# EAGLE design tinyvom (EAGLE 5.02)
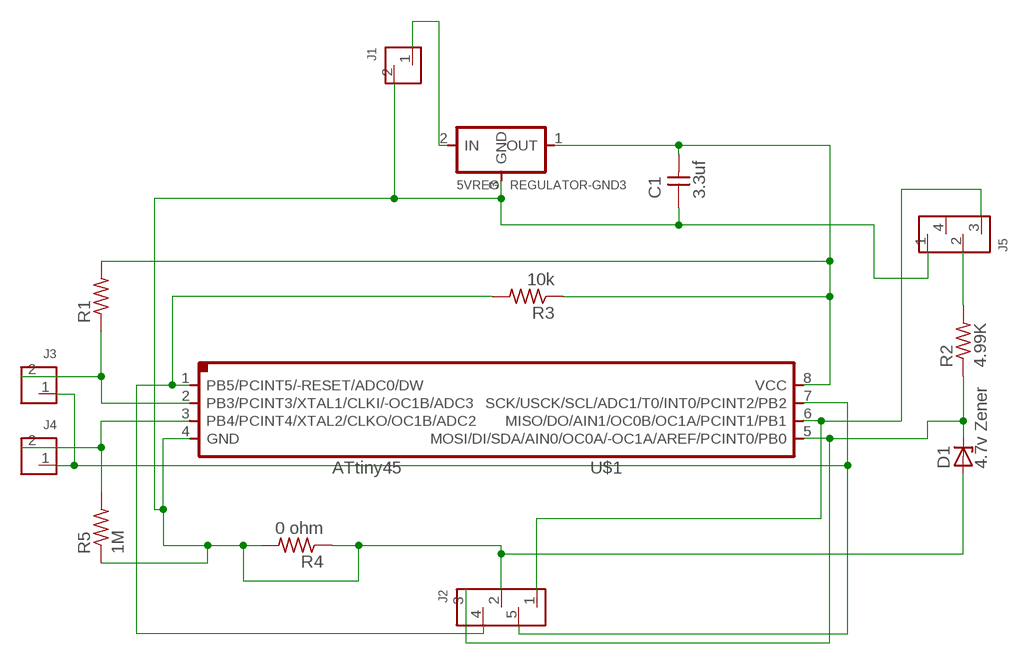
[diagram p0: schematic, sheet 1]

## Parts
5VREG  REGULATOR-GND3  [SOT-23]
C1  3.3uf  UNPOLARIZED_CAPACITOR1206  [1206]
D1  4.7v Zener  ZENER_DIODESOD123  [SOD123]
J1  MTA_2MTA_2  [MTA_2]
J2  MTA_5MTA_5  [MTA_5]
J3  MTA_2MTA_2  [MTA_2]
J4  MTA_2MTA_2  [MTA_2]
J5  MTA_4MTA_4  [MTA_4]
R1  RESISTOR1206  [1206]
R2  4.99K  RESISTOR1206  [1206]
R3  10k  RESISTOR1206  [1206]
R4  0 ohm  RESISTOR1206  [1206]
R5  1M  RESISTOR1206  [1206]
U$1  ATTINY45SI  [SOIC8]

## Nets
N$1: 5VREG.2(IN) J1.1
N$2: 5VREG.3(GND) C1.1 D1.ANODE J1.2 J2.2 J5.1 R4.1 R4.2 R5.1 U$1.4(GND)
N$3: 5VREG.1(OUT) C1.2 R1.2 R3.1 U$1.8(VCC)
N$4: D1.CATHODE J2.3 R2.1 U$1.5(MOSI/DI/SDA/AIN0/OC0A/-OC1A/AREF/PCINT0/PB0)
N$5: J2.1 J5.3 U$1.6(MISO/DO/AIN1/OC0B/OC1A/PCINT1/PB1)
N$6: J4.2 R5.2 U$1.3(PB4/PCINT4/XTAL2/CLKO/OC1B/ADC2)
N$8: J2.4 R3.2 U$1.1(PB5/PCINT5/-RESET/ADC0/DW)
N$10: J3.2 R1.1 U$1.2(PB3/PCINT3/XTAL1/CLKI/-OC1B/ADC3)
N$11: J5.2 R2.2
N$12: J2.5 J3.1 J4.1 U$1.7(SCK/USCK/SCL/ADC1/T0/INT0/PCINT2/PB2)
Unconnected: J5.4

## Library data of the parts
5VREG = cfd:REGULATOR-GND3
C1 = ng:UNPOLARIZED_CAPACITOR: unpolarized_capacitor
D1 = ng:ZENER_DIODE: zener diode
J1 J3 J4 = ng:MTA_2
J2 = ng:MTA_5
J5 = ng:MTA_4
R1-R5 = ng:RESISTOR
U$1 = ng:ATTINY45

## Board
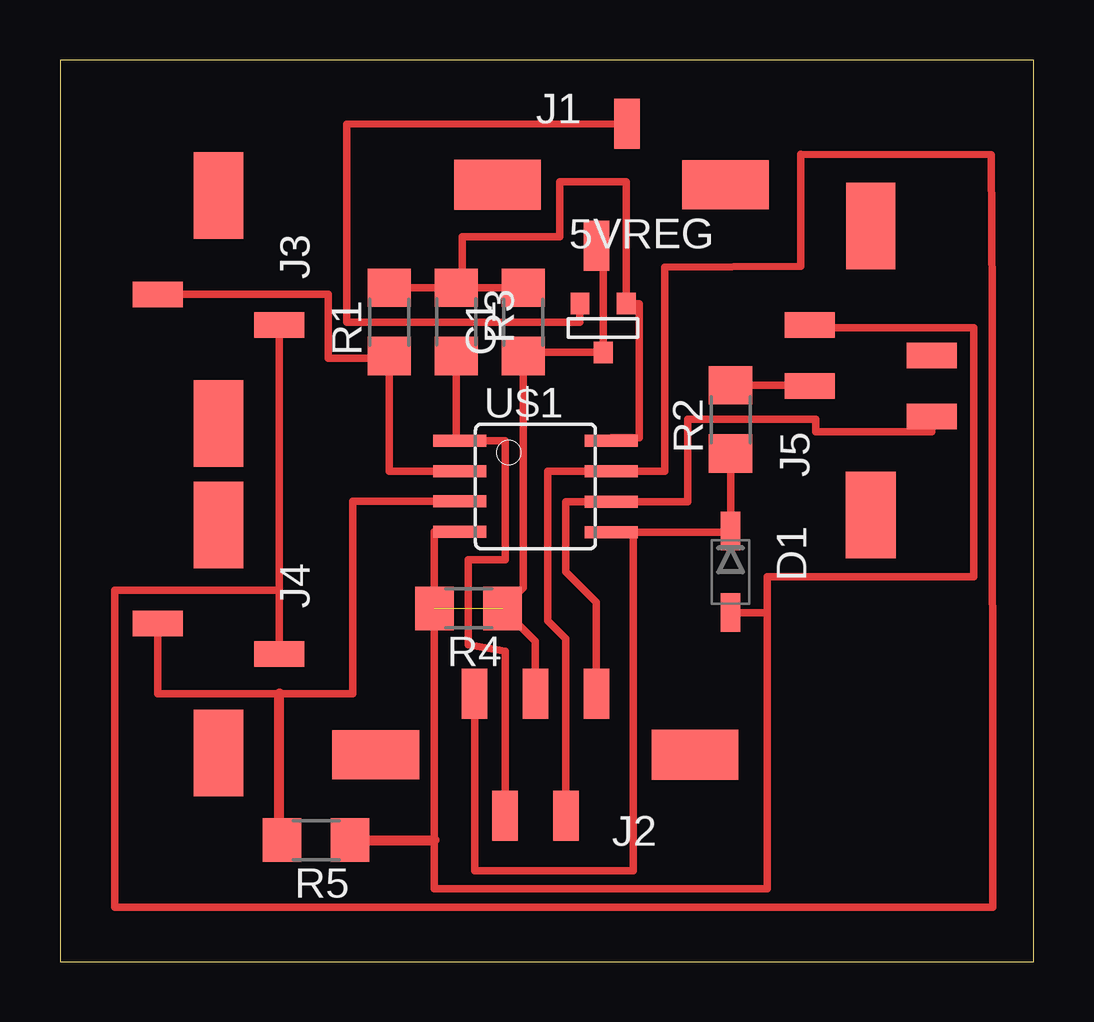
[diagram p1: board, top side]

Size 40.56 x 37.58 mm. Coordinates in mm from the lower left corner, seen from the top.
Outline: 0,0 40.56,0 40.56,37.58 0,37.58 0,0
Copper layers (1*16): Top 0.035mm / dielectric 1.5mm / Bottom 0.035mm
Design rules "default *": minimum track width 10mil, minimum drill 24mil, track to track 16mil, track to pad 16mil, pad to pad 16mil, via to via 16mil, smd to smd 8mil, copper to edge 40mil, drill to drill 8mil, minimum pad ring 10mil, minimum via ring 8mil, stop-mask expansion 4mil, vias tented up to drill 0mil, thermal gap 10mil

### Footprints (pad centres in the part's own frame; a part is rotated, then mirrored left to right if it is on the bottom)
SOT-23 = smd 0.787 x 0.889: 1 0.991,1.016; 2 -0.94,1.016; 3 0.025,-1.016
1206 = smd 1.6 x 1.803: 1 -1.422,0; 2 1.422,0
SOD123 = smd 1.6 x 0.8: ANODE 1.7,0; CATHODE -1.7,0
MTA_2 = smd 1.067 x 2.083: 1 -0.635,-2.54; 2 0.635,2.54 | smd 3.607 x 2.057: P$5 -4.75,0 | smd 3.607 x 2.083: P$6 4.75,0
MTA_5 = smd 1.067 x 2.083: 1 2.54,2.54; 2 0,2.54; 3 -2.54,2.54; 4 -1.27,-2.54; 5 1.27,-2.54 | smd 3.607 x 2.057: P$5 -6.655,0 | smd 3.607 x 2.083: P$6 6.655,0
MTA_4 = smd 1.067 x 2.083: 1 -1.905,-2.54; 2 0.635,-2.54; 3 1.905,2.54; 4 -0.635,2.54 | smd 3.607 x 2.057: P$5 -6.02,0 | smd 3.607 x 2.083: P$6 6.02,0
SOIC8 = smd 0.5 x 2.2: 1 -1.905,-3.154; 2 -0.645,-3.154; 3 0.625,-3.154; 4 1.895,-3.154; 5 1.905,3.154; 6 0.635,3.154; 7 -0.635,3.154; 8 -1.905,3.154

### Placement (x,y rotation side)
5VREG  22.61,26.42 0 top
C1  19.3,26.67 90 top
D1  27.94,16.26 270 top
J1  22.99,32.39 180 top
J2  19.81,8.64 0 top
J3  6.6,27.18 90 top
J4  6.6,13.46 90 top
J5  33.78,24.64 270 top
R1  13.72,26.67 90 top
R2  27.94,22.61 90 top
R3  16.51,26.67 270 top
R4  17.02,14.73 180 top
R5  10.67,5.08 180 top
U$1  19.81,19.81 270 top

### Tracks (layer width: path | path; a pad name or v marks a point on that pad's centre or on a via)
N$1
  Top 0.305: J1.1 11.94,34.9 11.94,26.64 21.67,26.64 5VREG.2
N$2  (1 unrouted)
  Top 0.305: U$1.4 15.6,17.92 R4.2 15.6,5.08 15.6,3.05 29.46,3.05 29.46,16.05 | 29.46,16.05 29.46,14.56 D1.ANODE | J2.2 19.81,13.36 R4.1 19.3,15.6 C1.1 19.3,25.4 5VREG.3 22.63,30.33 J1.2 | 31.24,26.42 38.08,26.42 38.08,16.05 29.46,16.05
  Top 0.406: 31.24,26.42 J5.1 | R5.1 15.6,5.08
N$3
  Top 0.305: R1.2 R3.1 | R3.1 16.26,28.09 16.26,27.69 16.76,27.69 16.76,30.23 20.83,30.23 20.83,32.51 23.6,32.51 5VREG.1 24.13,27.43 24.13,21.84 22.97,21.84 U$1.8 | R3.1 C1.2
N$4
  Top 0.305: R2.1 D1.CATHODE 27.94,17.91 24.13,17.91 | 24.13,17.91 U$1.5 | J2.3 17.27,3.81 23.88,3.81 23.88,17.91 24.13,17.91
N$5
  Top 0.305: J2.1 22.35,14.99 21.08,16.26 21.08,19.18 U$1.6 26.16,19.18 26.16,22.61 31.5,22.61 31.5,22.1 36.32,22.1 J5.3
N$6
  Top 0.305: J4.2 4.06,11.18 9.14,11.18 12.19,11.18 12.19,19.19 U$1.3
  Top 0.406: R5.2 9.14,5.08 9.14,11.18
N$8
  Top 0.305: R3.2 16.51,21.72 U$1.1 18.54,21.72 18.54,16.76 17.02,16.76 17.02,13.21 18.54,12.95 J2.4
N$10
  Top 0.305: U$1.2 13.72,20.46 13.72,24.64 | 13.72,24.64 R1.1 | J3.2 11.18,27.81 11.18,25.15 13.72,25.15 13.72,24.64
N$11
  Top 0.305: J5.2 31.24,24.03 R2.2
N$12
  Top 0.305: J3.1 J4.1 9.14,15.49 2.29,15.49 2.29,2.29 38.86,2.29 38.84,27.46 38.81,33.63 30.86,33.66 30.86,28.98 25.2,28.96 25.2,20.45 U$1.7 20.32,20.45 20.32,14.22 21.08,13.46 J2.5